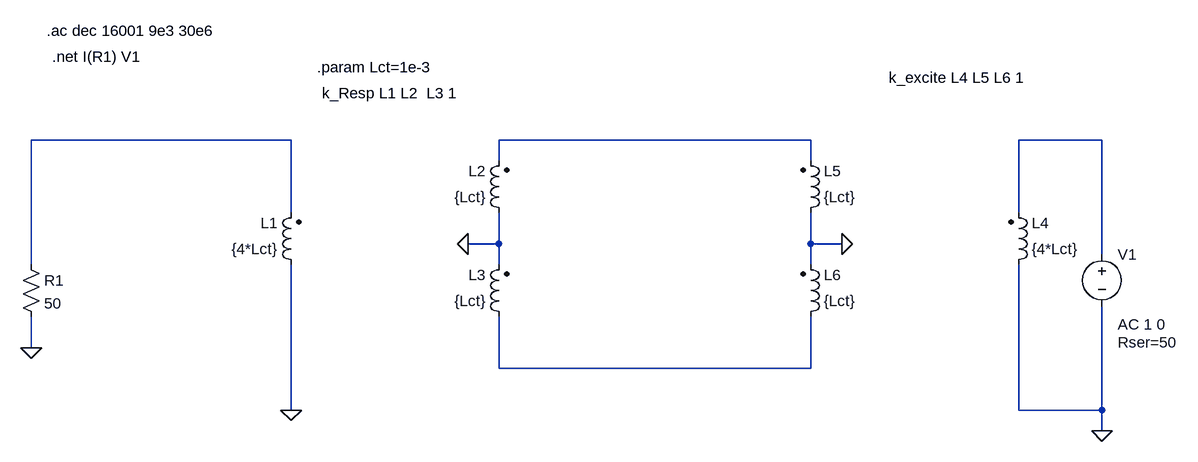
[diagram p0: schematic CM_DM_Power_Splitter.asc]
CM_DM_Power_Splitter.asc, the LTspice schematic file:
Version 4
SHEET 1 1408 932
WIRE 32 -96 -368 -96
WIRE 832 -96 352 -96
WIRE 1280 -96 1152 -96
WIRE 352 -64 352 -96
WIRE 832 -64 832 -96
WIRE 32 16 32 -96
WIRE 1152 16 1152 -96
WIRE 352 64 352 16
WIRE 352 64 304 64
WIRE 832 64 832 16
WIRE 880 64 832 64
WIRE 1280 80 1280 -96
WIRE -368 96 -368 -96
WIRE 352 96 352 64
WIRE 832 96 832 64
WIRE -368 224 -368 176
WIRE 352 256 352 176
WIRE 832 256 832 176
WIRE 832 256 352 256
WIRE 32 320 32 96
WIRE 1152 320 1152 96
WIRE 1280 320 1280 160
WIRE 1280 320 1152 320
WIRE 1280 352 1280 320
FLAG -368 224 0
FLAG 304 64 0
FLAG 32 320 0
FLAG 1280 352 0
FLAG 880 64 0
SYMBOL res -384 80 R0
SYMATTR InstName R1
SYMATTR Value 50
SYMBOL ind2 48 112 R180
WINDOW 0 36 80 Left 2
WINDOW 3 36 40 Left 2
SYMATTR InstName L1
SYMATTR Value {4*Lct}
SYMATTR Type ind
SYMBOL ind2 368 32 R180
WINDOW 0 36 80 Left 2
WINDOW 3 36 40 Left 2
SYMATTR InstName L2
SYMATTR Value {Lct}
SYMATTR Type ind
SYMBOL ind2 368 192 R180
WINDOW 0 36 80 Left 2
WINDOW 3 36 40 Left 2
SYMATTR InstName L3
SYMATTR Value {Lct}
SYMATTR Type ind
SYMBOL voltage 1280 64 R0
WINDOW 123 24 124 Left 2
WINDOW 39 24 152 Left 2
SYMATTR Value2 AC 1 0
SYMATTR SpiceLine Rser=50
SYMATTR InstName V1
SYMATTR Value ""
SYMBOL ind2 1136 112 M180
WINDOW 0 36 80 Left 2
WINDOW 3 36 40 Left 2
SYMATTR InstName L4
SYMATTR Value {4*Lct}
SYMATTR Type ind
SYMBOL ind2 816 32 M180
WINDOW 0 36 80 Left 2
WINDOW 3 36 40 Left 2
SYMATTR InstName L5
SYMATTR Value {Lct}
SYMATTR Type ind
SYMBOL ind2 816 192 M180
WINDOW 0 36 80 Left 2
WINDOW 3 36 40 Left 2
SYMATTR InstName L6
SYMATTR Value {Lct}
SYMATTR Type ind
TEXT 80 -168 Left 2 !k_Resp L1 L2  L3 1
TEXT 952 -192 Left 2 !k_excite L4 L5 L6 1
TEXT -336 -224 Left 2 !.net I(R1) V1
TEXT -344 -264 Left 2 !.ac dec 16001 9e3 30e6
TEXT 72 -208 Left 2 !.param Lct=1e-3

The netlist it stands for:
* CM_DM_Power_Splitter.asc
R1 N001 0 50
L1 0 N001 {4*Lct}
L2 0 N002 {Lct}
L3 N004 0 {Lct}
V1 N003 0 AC 1 0 Rser=50
L4 0 N003 {4*Lct}
L5 0 N002 {Lct}
L6 N004 0 {Lct}
k_Resp L1 L2  L3 1
k_excite L4 L5 L6 1
.net I(R1) V1
.ac dec 16001 9e3 30e6
.param Lct=1e-3
.backanno
.end